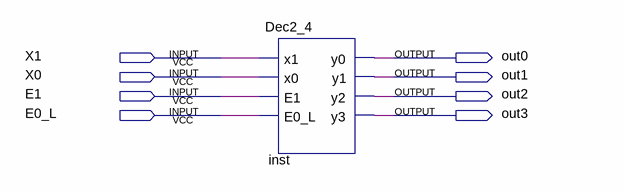
[diagram p0: schematic sheet]
// Quartus schematic DecoderDemo.bdf as structural Verilog: 1 symbols, 8 pins
module DecoderDemo (
  input  X1,
  input  X0,
  input  E1,
  input  E0_L,
  output out0,
  output out1,
  output out2,
  output out3
);

  Dec2_4 inst (.x1(X1), .x0(X0), .E1(E1), .E0_L(E0_L), .y0(out0), .y1(out1), .y2(out2), .y3(out3));
endmodule
